# Altium schematic sheet Buttons.SchDoc
size Letter; CompanyName: Ploopy Corporation; Organization: Ploopy Corporation; Address1: 137-1140 Burnhamthorpe Road W; Address2: Mississauga; Address3: Ontario; Address4: Canada L5C 0A3; DocumentNumber: 2; Revision: R1.003; SheetNumber: 2; SheetTotal: 9
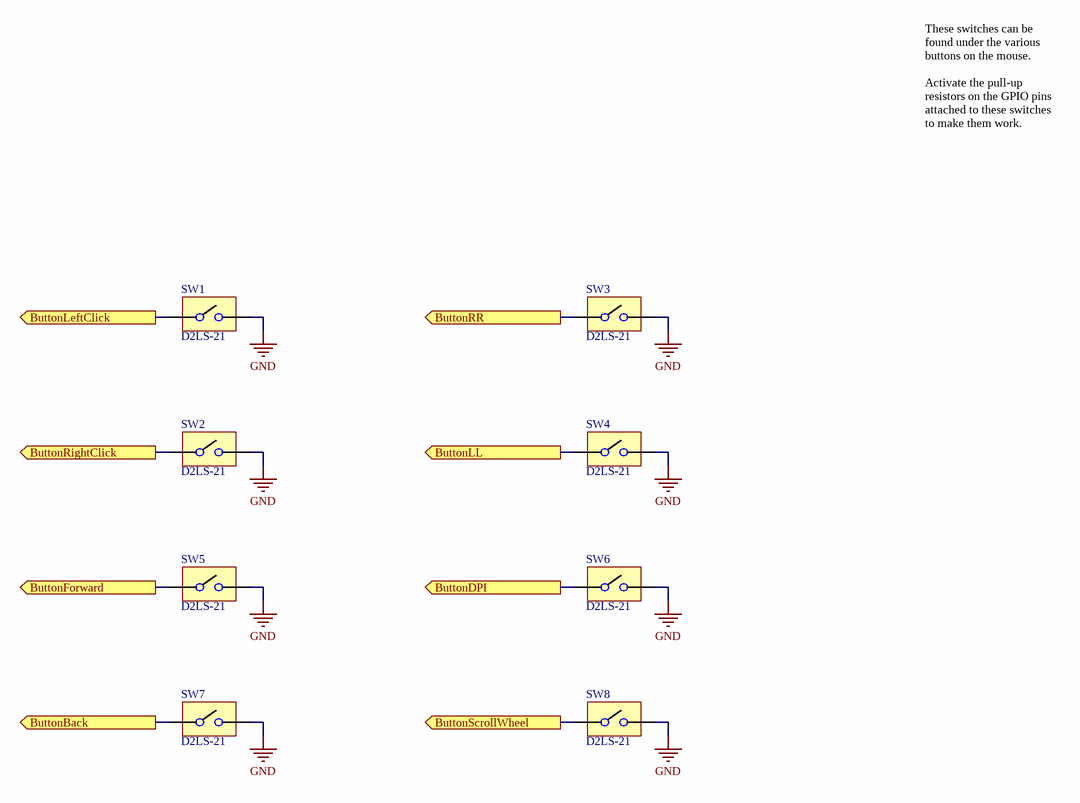
[diagram p0: Buttons.SchDoc]

## Parts
SW1  D2LS-21  [D2LS-21]
SW2  D2LS-21  [D2LS-21]
SW3  D2LS-21  [D2LS-21]
SW4  D2LS-21  [D2LS-21]
SW5  D2LS-21  [D2LS-21]
SW6  D2LS-21  [D2LS-21]
SW7  D2LS-21  [D2LS-21]
SW8  D2LS-21  [D2LS-21]

## Ports
ButtonBack (out), ButtonDPI (out), ButtonForward (out), ButtonLeftClick (out), ButtonLL (out), ButtonRightClick (out), ButtonRR (out), ButtonScrollWheel (out)

## Nets
GND: SW1.B SW2.B SW3.B SW4.B SW5.B SW6.B SW7.B SW8.B
ButtonBack: SW7.A ; port ButtonBack
ButtonDPI: SW6.A ; port ButtonDPI
ButtonForward: SW5.A ; port ButtonForward
ButtonLeftClick: SW1.A ; port ButtonLeftClick
ButtonLL: SW4.A ; port ButtonLL
ButtonRightClick: SW2.A ; port ButtonRightClick
ButtonRR: SW3.A ; port ButtonRR
ButtonScrollWheel: SW8.A ; port ButtonScrollWheel

## Notes on the sheet
- These switches can be found under the various buttons on the mouse.
  Activate the pull-up resistors on the GPIO pins attached to these switches to make them work.
- Copyright Ploopy Corporation 2024
- Licensed under the CERN-OHL-S v2
- http://ohwr.org/cernohl
- Title:
- PCB:
- Version:
- Ploopy Corporation
- Mississauga ON L5C 0A3
- 137-1140 Burnhamthorpe Road W
- Date:
- Time:
- Sheet
- of
- Canada

## Library data of the parts
SW1-SW8 = D2LS-21: Compact Surface-mounting Switch for long durability; Supplier 1: Digi-Key; Supplier 2: Mouser; Supplier Part Number 1: Z4378CT-ND; Supplier Part Number 2: 653-D2LS-21